# EAGLE design PrjBlinkenlights (EAGLE 5.12)
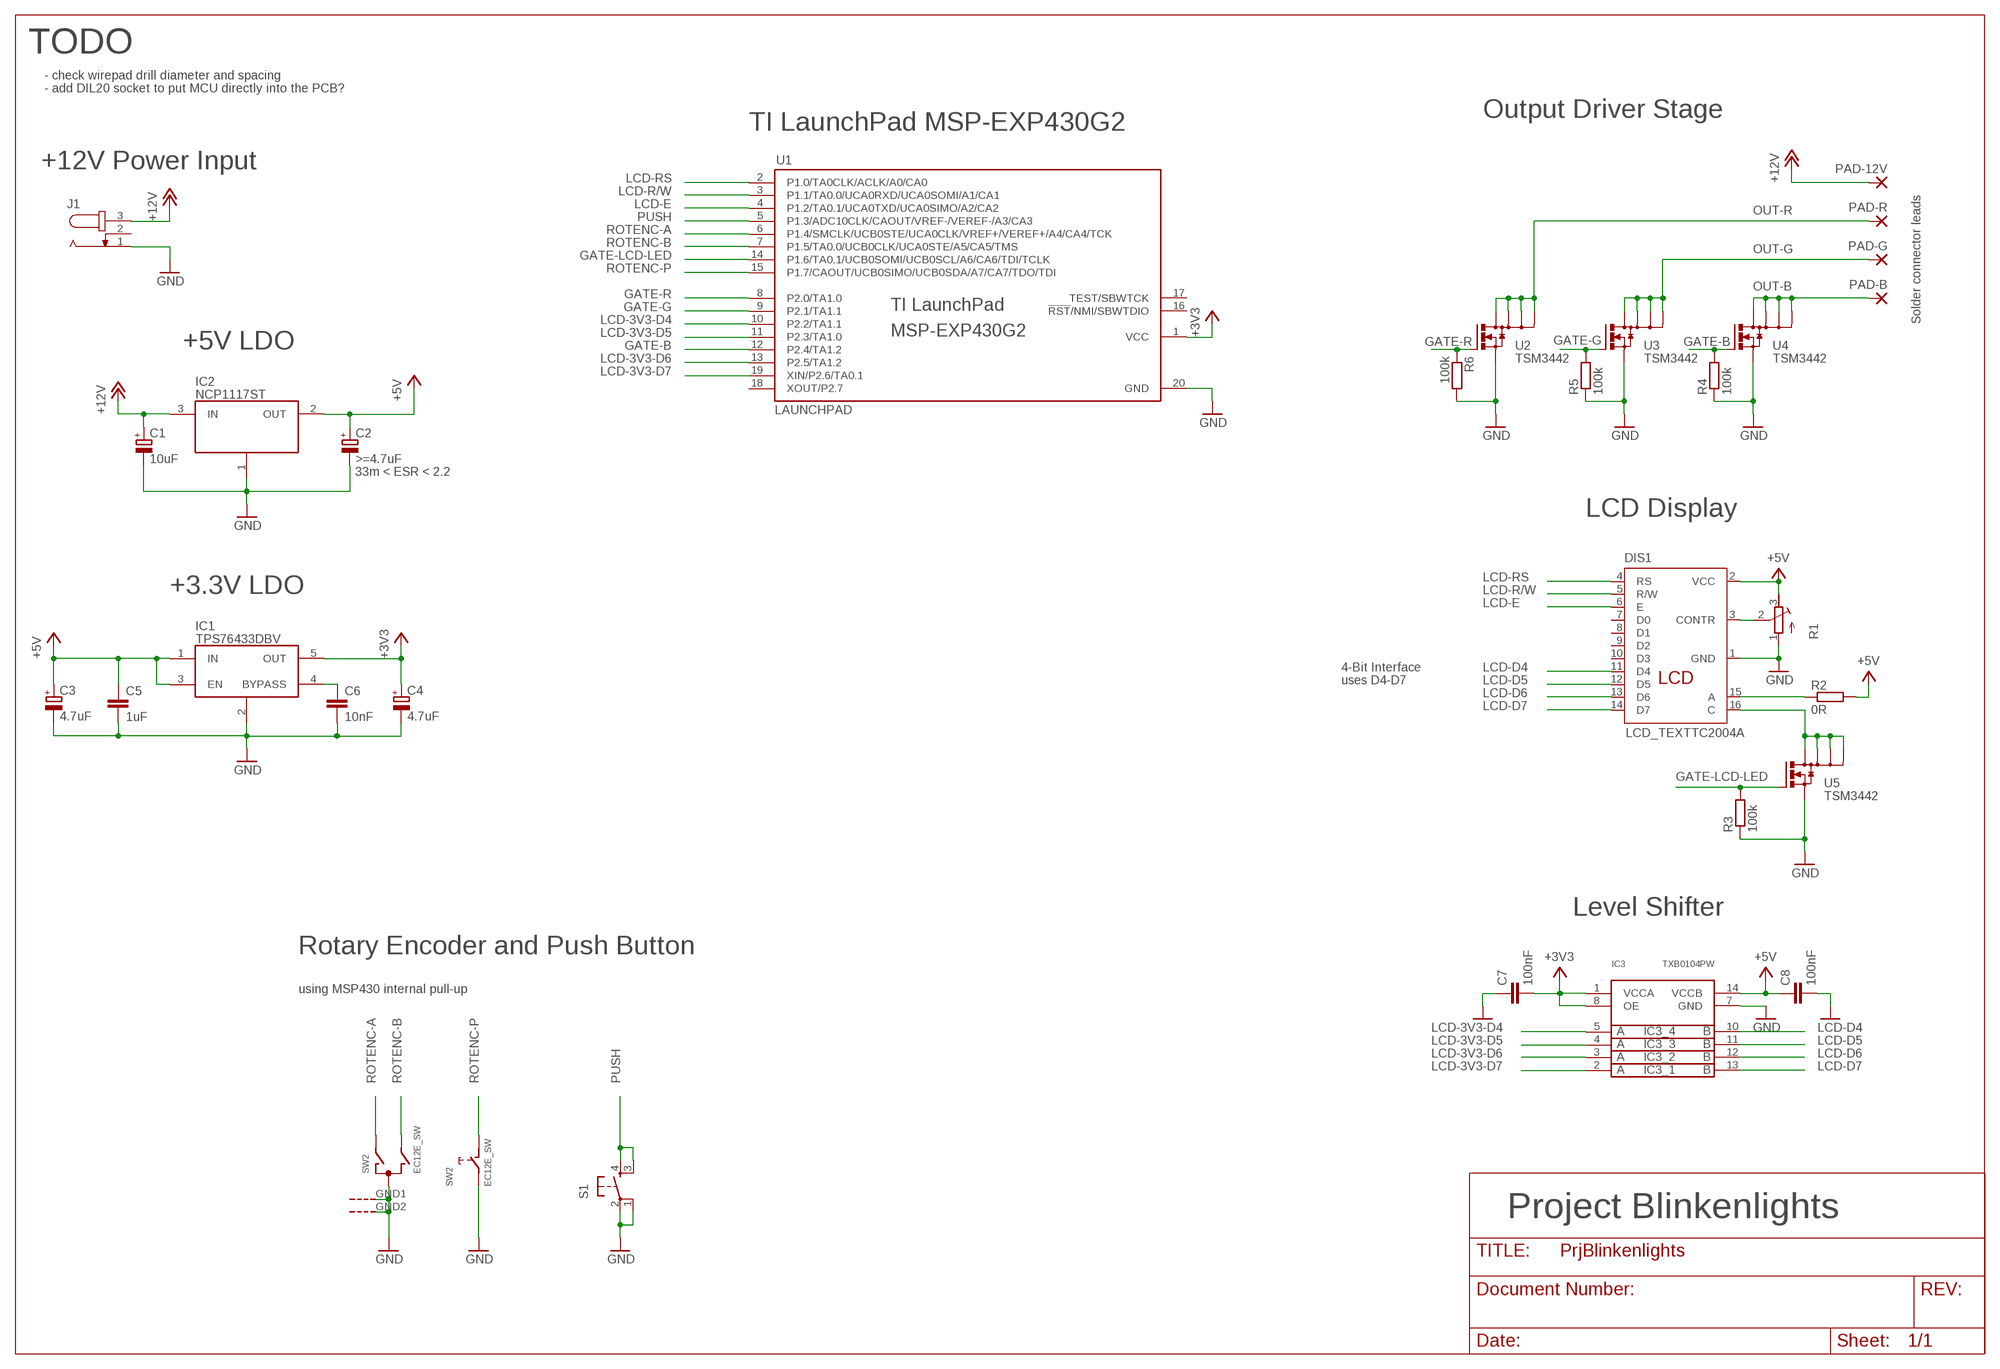
[diagram p0: schematic, sheet 1]

## Parts
C1  10uF  CPOL-EUCT3528  [CT3528]
C2  >=4.7uF  CPOL-EUCT3528  [CT3528]
C3  4.7uF  CPOL-EUCT3528  [CT3528]
C4  4.7uF  CPOL-EUCT3528  [CT3528]
C5  1uF  C-EUC0603  [C0603]
C6  10nF  C-EUC0603  [C0603]
C7  100nF  C-EUC0603  [C0603]
C8  100nF  C-EUC0603  [C0603]
DIS1  LCD_TEXTTC2004A  [TC2004A]
IC1  TPS76433DBV  [SOT23-5L]
IC2  NCP1117ST  [SOT223]
IC3  TXB0104PW  [R-PDSO-G14]
J1  JACK-PLUG0  [SPC4077]
PAD-12V  WIREPAD3,81/1,4  [3,81/1,4]
PAD-B  WIREPAD3,81/1,4  [3,81/1,4]
PAD-G  WIREPAD3,81/1,4  [3,81/1,4]
PAD-R  WIREPAD3,81/1,4  [3,81/1,4]
R1  R-TRIMM64P  [RTRIM64P]
R2  0R  R-EU_R0603  [R0603]
R3  100k  R-EU_R0603  [R0603]
R4  100k  R-EU_R0603  [R0603]
R5  100k  R-EU_R0603  [R0603]
R6  100k  R-EU_R0603  [R0603]
S1  SMD-BUTTON  [SMD-BUTTON]
SW2  EC12E_SW  [ALPS_EC12E_SW]
U1  LAUNCHPAD  [LAUNCHPAD]
U2  TSM3442  [SOT23-6]
U3  TSM3442  [SOT23-6]
U4  TSM3442  [SOT23-6]
U5  TSM3442  [SOT23-6]

## Nets
+3V3: C4.+ C7.2 IC1.5(OUT) IC3.1(:VCCA) IC3.8(:OE) U1.1(VCC)
+5V: C2.+ C3.+ C5.1 C8.1 DIS1.2(VCC) IC1.1(IN) IC1.3(EN) IC2.2(OUT) IC3.14(:VCCB) R1.3(E) R2.2
+12V: C1.+ IC2.3(IN) J1.3 PAD-12V.1(P)
BYPASS: C6.1 IC1.4(BYPASS)
CONTR: DIS1.3(CONTR) R1.2(S)
GATE-B: R4.2 U1.12(P2.4/TA1.2) U4.3(G)
GATE-G: R5.2 U1.9(P2.1/TA1.1) U3.3(G)
GATE-LCD-LED: R3.2 U1.14(P1.6/TA0.1/UCB0SOMI/UCB0SCL/A6/CA6/TDI/TCLK) U5.3(G)
GATE-R: R6.1 U1.8(P2.0/TA1.0) U2.3(G)
GND: C1.- C2.- C3.- C4.- C5.2 C6.2 C7.1 C8.2 DIS1.1(GND) IC1.2(GND) IC2.1(GND) IC3.7(:GND) J1.1 R1.1(A) R3.1 R4.1 R5.1 R6.2 S1.1 S1.2(P) SW2.C SW2.E SW2.GND1(G) SW2.GND2(G) U1.20(GND) U2.4(S) U3.4(S) U4.4(S) U5.4(S)
LCD-3V3-D4: IC3.5(_4:A) U1.10(P2.2/TA1.1)
LCD-3V3-D5: IC3.4(_3:A) U1.11(P2.3/TA1.0)
LCD-3V3-D6: IC3.3(_2:A) U1.13(P2.5/TA1.2)
LCD-3V3-D7: IC3.2(_1:A) U1.19(XIN/P2.6/TA0.1)
LCD-D4: DIS1.11(D4) IC3.10(_4:B)
LCD-D5: DIS1.12(D5) IC3.11(_3:B)
LCD-D6: DIS1.13(D6) IC3.12(_2:B)
LCD-D7: DIS1.14(D7) IC3.13(_1:B)
LCD-E: DIS1.6(E) U1.4(P1.2/TA0.1/UCA0TXD/UCA0SIMO/A2/CA2)
LCD-LED-A: DIS1.15(A) R2.1
LCD-LED-C: DIS1.16(C) U5.1(D1) U5.2(D2) U5.5(D3) U5.6(D4)
LCD-R/W: DIS1.5(R/W) U1.3(P1.1/TA0.0/UCA0RXD/UCA0SOMI/A1/CA1)
LCD-RS: DIS1.4(RS) U1.2(P1.0/TA0CLK/ACLK/A0/CA0)
OUT-B: PAD-B.1(P) U4.1(D1) U4.2(D2) U4.5(D3) U4.6(D4)
OUT-G: PAD-G.1(P) U3.1(D1) U3.2(D2) U3.5(D3) U3.6(D4)
OUT-R: PAD-R.1(P) U2.1(D1) U2.2(D2) U2.5(D3) U2.6(D4)
PUSH: S1.3(S1) S1.4(S) U1.5(P1.3/ADC10CLK/CAOUT/VREF-/VEREF-/A3/CA3)
ROTENC-A: SW2.A U1.6(P1.4/SMCLK/UCB0STE/UCA0CLK/VREF+/VEREF+/A4/CA4/TCK)
ROTENC-B: SW2.B U1.7(P1.5/TA0.0/UCB0CLK/UCA0STE/A5/CA5/TMS)
ROTENC-P: SW2.D U1.15(P1.7/CAOUT/UCB0SIMO/UCB0SDA/A7/CA7/TDO/TDI)
Unconnected: DIS1.7(D0) DIS1.8(D1) DIS1.9(D2) DIS1.10(D3) J1.2 U1.16(!RST!/NMI/SBWTDIO) U1.17(TEST/SBWTCK) U1.18(XOUT/P2.7)

## Notes on the sheet
- TODO
- - check wirepad drill diameter and spacing
- - add DIL20 socket to put MCU directly into the PCB?
- Output Driver Stage
- TI LaunchPad MSP-EXP430G2
- +12V Power Input
- Solder connector leads
- +5V LDO
- 33m < ESR < 2.2
- LCD Display
- +3.3V LDO
- 4-Bit Interface
- uses D4-D7
- Level Shifter
- Rotary Encoder and Push Button
- using MSP430 internal pull-up
- Project Blinkenlights

## Library data of the parts
C1-C4 = rcl:CPOL-EU: POLARIZED CAPACITOR, European symbol
C5-C8 = rcl:C-EU: CAPACITOR, European symbol
DIS1 = PrjBlinkenlights:LCD_TEXT: Vatronix Text LCD display reflective, with background light; OC_FARNELL: unknown; OC_NEWARK: unknown
IC1 = parts:TPS764*: TPS764xx LOW-POWER LOW-NOISE 150-mA LOW-DROPOUT LINEAR REGULATORS
IC2 = PrjBlinkenlights:NCP1117: ON Semiconductor 1.0 A Low-Dropout Positive Fixed and Adjustable Voltage Regulators SOT-223 Package (ST suffix): Heatsink tab is connected to Pin 2 (Output).
IC3 = PrjBlinkenlights:TXB0104: TXS0108E 4-BIT BIDIRECTIONAL VOLTAGE-LEVEL TRANSLATOR WITH AUTOMATIC DIRECTION SENSING AND ±15-kV ESD PROTECTION
J1 = con-jack:JACK-PLUG: DC POWER JACK Power Jack, DC, Right Angle, Through Hole, Rated 5A at 16VDC, PC Terminals Distributor: Farnell (www.Farnell.de) Drawing: 84N1161.pdf / 84N1162.pdf Manufacturer: SPC Technology (www.spctechnology.com) Type: SPC4077 / SPC 4078; OC_FARNELL: unknown; OC_NEWARK: unknown
PAD-12V PAD-B PAD-G PAD-R = wirepad:WIREPAD: Wire PAD connect wire on PCB
R1 = rcl:R-TRIMM: Trimm resistor
R2-R6 = rcl:R-EU_: RESISTOR, European symbol
S1 = PrjBlinkenlights:SMD-BUTTON: OMRON SWITCH
SW2 = switch-alps:EC12E_SW: ALPS rotary Encoder EC12E series with switch; MPN: EC12E2424407; OC_FARNELL: 1520813; OC_NEWARK: 74M1068
U1 = PrjBlinkenlights:LAUNCHPAD: TI LaunchPad MSP-EXP430G2
U2-U5 = PrjBlinkenlights:TSM3442: TSM3442 20V N-Channel MOSFET VDS < 20V VGS < ±8V ID < 4A Rθ,JA = 80°C/W VGS,th = 0.65-1.2V SOT-26 Package seems identical to SOT23-6

## Board
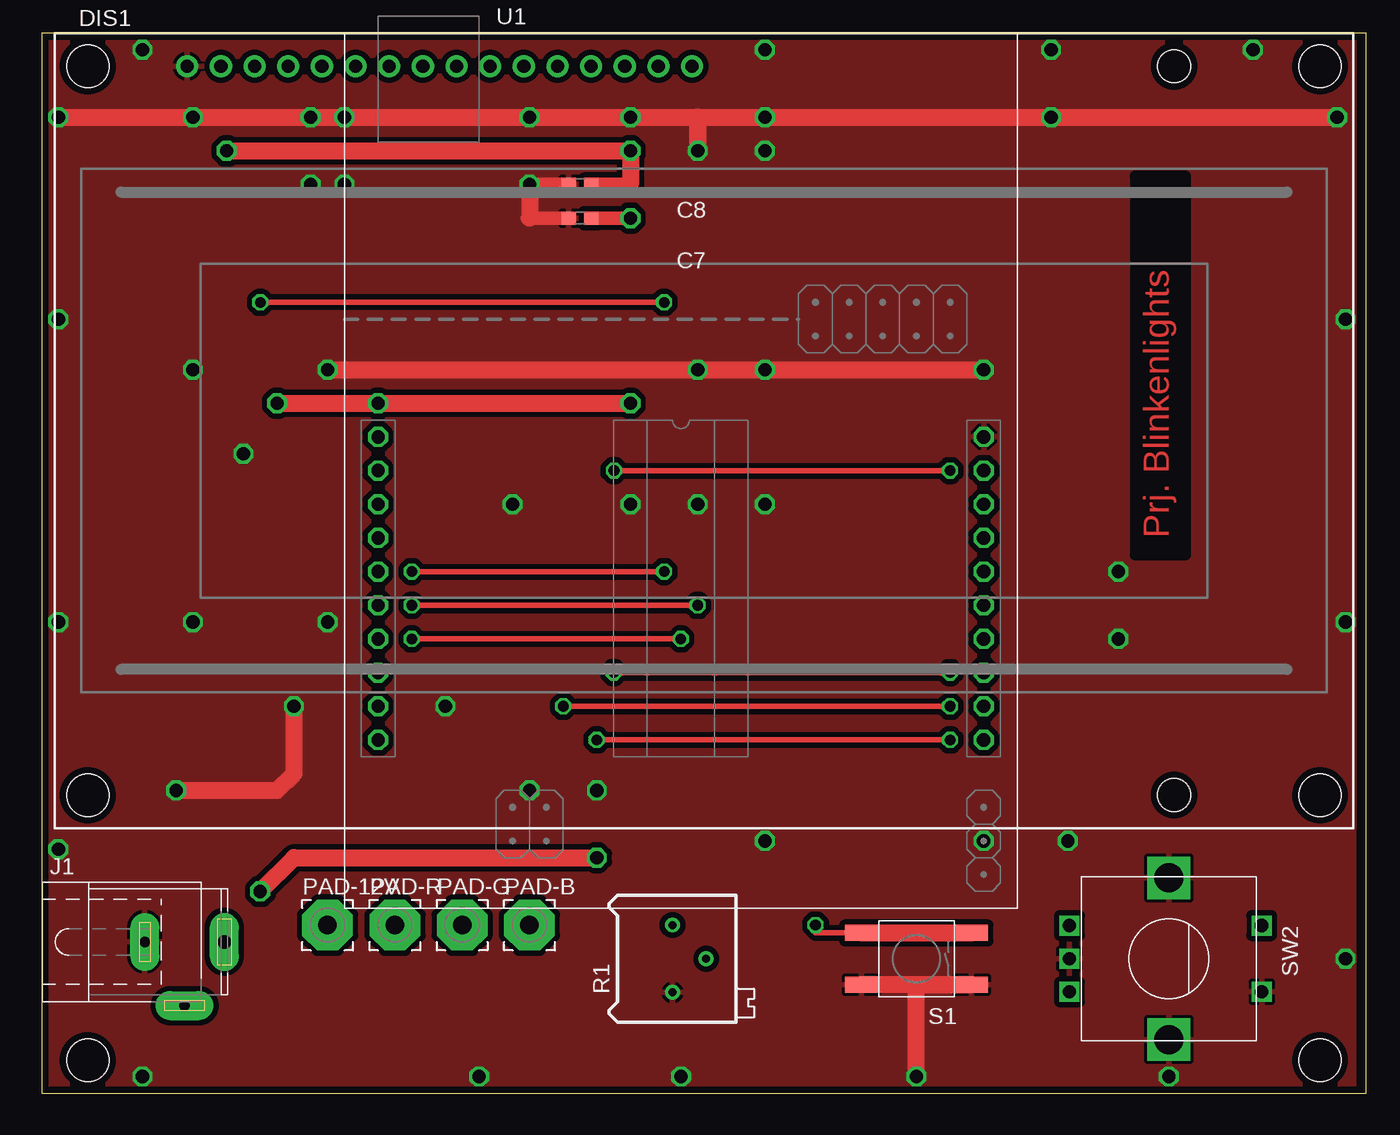
[diagram p1: board, top side]
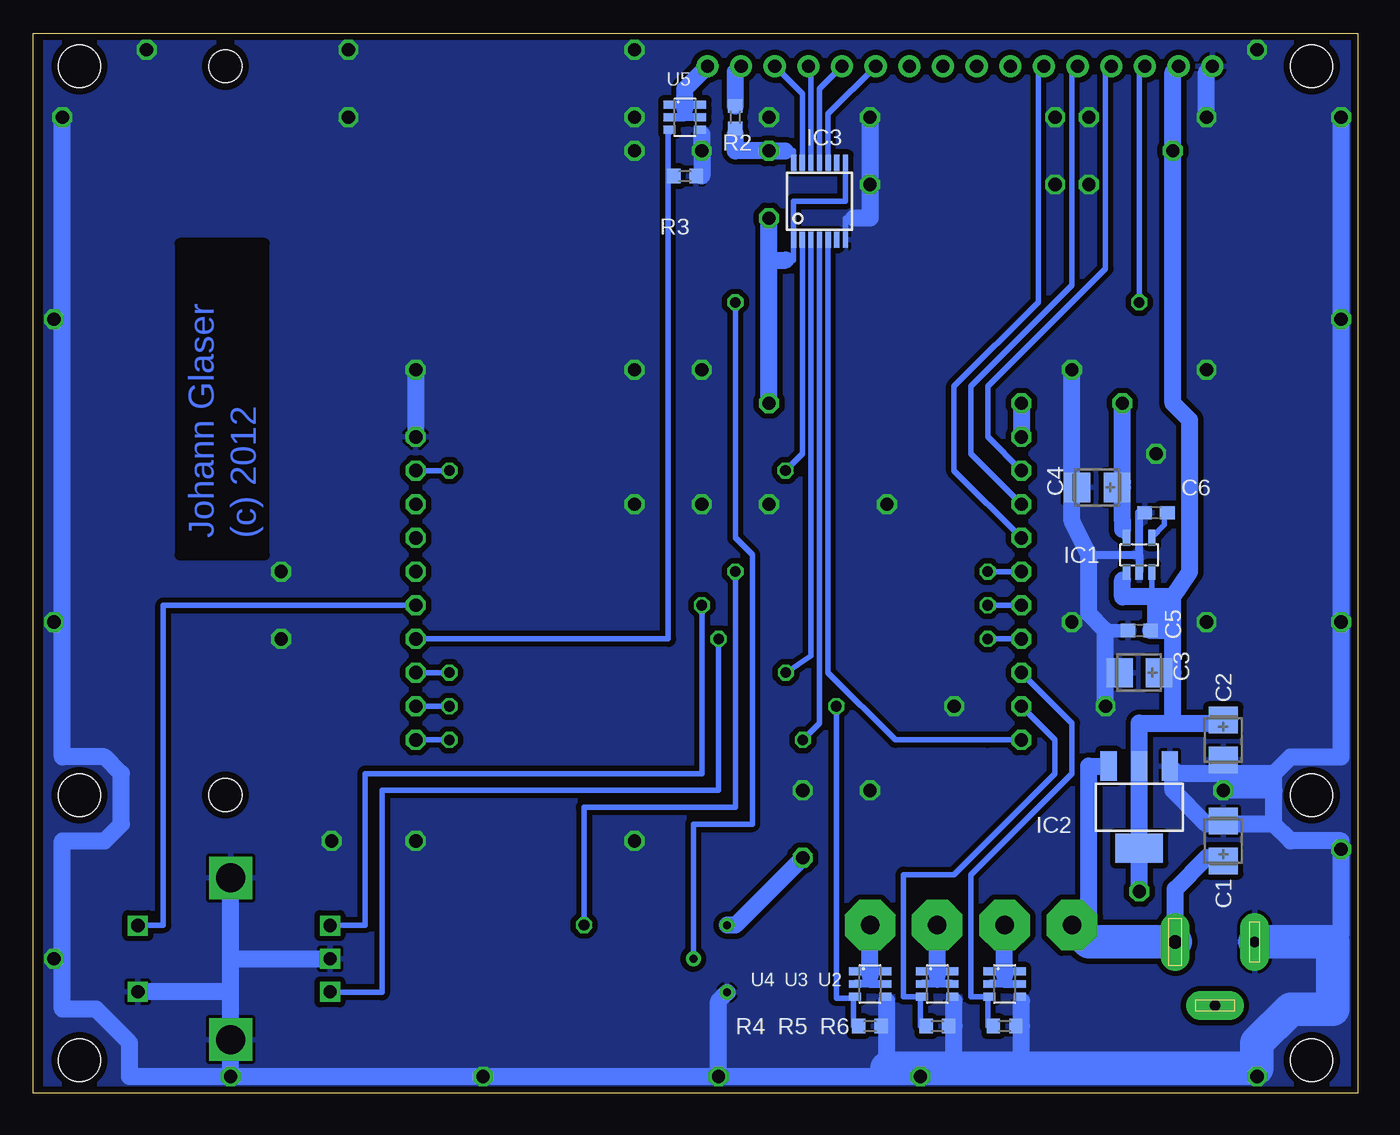
[diagram p2: board, bottom side, seen from below]

Size 100 x 80 mm. Coordinates in mm from the lower left corner, seen from the top.
Outline: 0,0 100,0 100,80 0,80 0,0
Copper layers (1*16): Top 0.035mm / dielectric 1.5mm / Bottom 0.035mm
Design rules "heger *": minimum track width 10mil, minimum drill 0.5mm, track to track 9mil, track to pad 9mil, pad to pad 9mil, via to via 10mil, smd to smd 8mil, copper to edge 20mil, drill to drill 0.5mm, minimum pad ring 10mil, minimum via ring 8mil, stop-mask expansion 4mil, vias tented up to drill 0mil, thermal gap 10mil
Holes 3.2 mm at 3.5,2.5 96.5,2.5
Holes 2.5 mm at 85.5,77.5 85.5,22.5
tRestrict: 4 lines
bRestrict: 4 lines

### Footprints (pad centres in the part's own frame; a part is rotated, then mirrored left to right if it is on the bottom)
CT3528 = smd 2 x 2.2: + -1.5,0; - 1.5,0
C0603 = smd 1.1 x 1: 1 -0.85,0; 2 0.85,0
TC2004A = drill 1 pad 1.676 round: 1 10,-2.5; 2 12.54,-2.5; 3 15.08,-2.5; 4 17.62,-2.5; 5 20.16,-2.5; 6 22.7,-2.5; 7 25.24,-2.5; 8 27.78,-2.5; 9 30.32,-2.5; 10 32.86,-2.5; 11 35.4,-2.5; 12 37.94,-2.5; 13 40.48,-2.5; 14 43.02,-2.5; 15 45.56,-2.5; 16 48.1,-2.5 | hole 3.2: 2.5,-57.5; 95.5,-57.5; 2.5,-2.5; 95.5,-2.5
SOT23-5L = smd 0.55 x 1.2: 1 -0.95,-1.3; 2 0,-1.3; 3 0.95,-1.3; 4 0.95,1.3; 5 -0.95,1.3
SOT223 = smd 1.219 x 2.235: 1 -2.311,-3.099; 2 0,-3.099; 3 2.311,-3.099 | smd 3.6 x 2.2: 4 0,3.099
R-PDSO-G14 = smd 0.4 x 1.2: 1 -1.95,-2.9; 2 -1.3,-2.9; 3 -0.65,-2.9; 4 0,-2.9; 5 0.65,-2.9; 6 1.3,-2.9; 7 1.95,-2.9; 8 1.95,2.9; 9 1.3,2.9; 10 0.65,2.9; 11 0,2.9; 12 -0.65,2.9; 13 -1.3,2.9; 14 -1.95,2.9
SPC4077 = drill 0.8 pad 2.184 long: 1 -3,0; 2 0,-4.8 | drill 1 pad 2.184 long: 3 3,0
3,81/1,4 = drill 1.397 pad 3.81 octagon: 1 0,0
RTRIM64P = drill 0.61 round: 1 0,-2.54; 2 2.54,0; 3 0,2.54
R0603 = smd 1 x 1.1: 1 -0.85,0; 2 0.85,0
SMD-BUTTON = smd 2.5 x 1.2: 1 -4.15,1.95; 2 4.15,1.95; 3 -4.15,-1.95; 4 4.15,-1.95
ALPS_EC12E_SW = drill 1 square: A -2.5,-7.5; B 2.5,-7.5; C 0,-7.5; D -2.5,7; E 2.5,7 | drill 2.2 square: GND1 -6.1,0; GND2 6.1,0
LAUNCHPAD = drill 1 octagon: 1 -22.86,11.43; 2 -22.86,8.89; 3 -22.86,6.35; 4 -22.86,3.81; 5 -22.86,1.27; 6 -22.86,-1.27; 7 -22.86,-3.81; 8 -22.86,-6.35; 9 -22.86,-8.89; 10 -22.86,-11.43; 11 22.86,-11.43; 12 22.86,-8.89; 13 22.86,-6.35; 14 22.86,-3.81; 15 22.86,-1.27; 16 22.86,1.27; 17 22.86,3.81; 18 22.86,6.35; 19 22.86,8.89; 20 22.86,11.43
SOT23-6 = smd 0.6 x 0.9: 1 -0.95,-1.15; 2 0,-1.15; 3 0.95,-1.15; 4 0.95,1.15; 5 0,1.15; 6 -0.95,1.15

### Placement (x,y rotation side)
C1  10.16,19.05 90 bottom
C2  10.16,26.67 270 bottom
C3  16.51,31.75 180 bottom
C4  19.68,45.72 180 bottom
C5  16.51,34.92 180 bottom
C6  15.24,43.81 180 bottom
C7  40.64,66.04 0 top
C8  40.64,68.58 180 top
DIS1  1,80 0 top
IC1  16.51,40.64 0 bottom
IC2  16.51,21.59 180 bottom
IC3  40.64,67.31 0 bottom
J1  10.79,11.43 0 top
PAD-12V  21.59,12.7 0 top
PAD-B  36.83,12.7 0 top
PAD-G  31.75,12.7 0 top
PAD-R  26.67,12.7 0 top
R1  47.62,10.16 0 top
R2  46.99,73.66 270 bottom
R3  50.8,69.22 180 bottom
R4  36.83,5.08 180 bottom
R5  31.75,5.08 180 bottom
R6  26.67,5.08 0 bottom
S1  66.04,10.16 180 top
SW2  85.09,10.16 270 top
U1  48.26,38.1 0 top
U2  26.67,8.26 270 bottom
U3  31.75,8.26 270 bottom
U4  36.83,8.26 270 bottom
U5  50.8,73.66 270 bottom

### Tracks (layer width: path | path; a pad name or v marks a point on that pad's centre or on a via)
+3V3  (via drill 1)
  Top 1.016: v44.45,66.04 C7.2
  Top 1.27: v17.78,52.07 v25.4,52.07 v44.45,52.07
  Bottom 0.406: IC3.8 38.69,67.31 42.59,67.31 IC3.1 42.59,62.87 43.18,62.87
  Bottom 0.61: IC1.5 17.78,42.26 17.78,43.18
  Bottom 1.27: v17.78,52.07 17.78,46.12 C4.+ 17.78,45.72 17.78,43.18 17.78,42.55 | v25.4,52.07 U1.1 | 44.45,62.87 v44.45,66.04 | 44.45,62.87 43.18,62.87 | v44.45,52.07 44.45,62.87
+5V  (via drill 1)
  Top 1.016: 44.45,68.58 C8.1
  Top 1.27: v13.97,71.12 v44.45,71.12 44.45,68.58 | v16.51,15.24 19.05,17.78 v41.91,17.78
  Bottom 0.406: 15.56,36.83 IC1.3 | 17.78,38.73 IC1.1 | 43.23,71.12 42.59,71.12 IC3.14
  Bottom 0.61: 15.24,37.47 15.24,36.83 15.56,36.83 | 46.99,72.39 R2.2
  Bottom 1.27: 13.97,27.94 16.51,27.94 IC2.2 v16.51,15.24 | 13.97,27.94 10.16,27.94 C2.+ | DIS1.2 13.97,77.07 v13.97,71.12 13.97,52.07 12.7,50.8 12.7,39.37 13.97,37.47 | 13.97,27.94 13.97,31.75 | 13.97,31.75 13.97,34.92 | 13.97,34.92 13.97,37.47 | 13.97,31.75 C3.+ | 13.97,34.92 15.24,34.92 | 15.24,34.92 C5.1 | 15.24,34.92 15.24,37.47 | 17.78,38.73 17.78,37.47 15.24,37.47 | 13.97,37.47 15.24,37.47 | 46.99,72.39 46.99,71.12 v44.45,71.12 43.23,71.12 | v41.91,17.78 46.99,12.7 R1.3
+12V
  Bottom 1.27: IC2.3 20.32,24.69 20.32,11.43 | J1.3 13.79,15.41 11.43,17.78 10.39,17.78 C1.+
  Bottom 2.54: J1.3 20.32,11.43 PAD-12V.1
BYPASS
  Bottom 0.406: IC1.4 14.61,42.9 14.61,43.81 C6.1
CONTR  (via drill 0.8)
  Top 0.406: v46.99,59.69 v16.51,59.69
  Bottom 0.406: R1.2 50.16,20.32 45.72,20.32 45.72,40.64 46.99,41.91 v46.99,59.69 | v16.51,59.69 16.51,77.07 DIS1.3
GATE-B  (via drill 0.8)
  Top 0.406: v39.37,29.21 v68.58,29.21
  Bottom 0.406: 38.1,7.18 U4.3 | 38.1,7.18 38.1,5.08 R4.2 | 38.1,7.18 39.37,7.18 v39.37,29.21 | v68.58,29.21 U1.12
GATE-G
  Bottom 0.406: R5.2 33.02,5.08 33.02,7.18 U3.3 34.29,7.3 34.29,16.51 30.48,16.51 22.86,24.13 22.86,26.67 U1.9
GATE-LCD-LED
  Bottom 0.406: U5.3 51.95,72.51 52.07,72.39 52.07,69.22 | 52.07,69.22 R3.2 | 52.07,69.22 52.07,34.29 U1.14
GATE-R
  Bottom 0.406: R6.1 27.94,5.08 27.94,7.18 U2.3 29.21,7.3 29.21,16.51 21.59,24.13 21.59,27.94 U1.8
GND  (via drill 1)
  Top 1.016: v36.83,68.58 C8.2 | 36.83,66.04 C7.1
  Top 1.27: v1.27,73.66 v11.43,73.66 v20.32,73.66 v22.86,73.66 v36.83,73.66 v44.45,73.66 49.53,73.66 | 49.53,73.66 v54.61,73.66 v76.2,73.66 v97.79,73.66 | v10.16,22.86 17.78,22.86 19.05,24.13 v19.05,29.21 | v21.59,54.61 v49.53,54.61 v54.61,54.61 v71.12,54.61 | v36.83,68.58 36.83,66.04 | 49.53,73.66 v49.53,71.12 | S1.2 S1.1 66.04,8.21 v66.04,1.27
  Bottom 0.406: 38.05,66.04 38.69,66.04 IC3.7
  Bottom 0.61: 26.67,1.91 25.52,1.91 | 30.48,6.99 U3.4 | 35.56,6.99 U4.4 | 25.4,6.99 U2.4 | 30.48,5.08 R5.1 | 35.56,5.08 R4.1 | 25.4,5.08 R6.2 | 20.32,40.64 16.51,40.64 | 16.51,40.64 IC1.2 | 16.51,40.64 16.51,43.81 C6.2 | 49.53,72.39 U5.4 | 49.53,69.22 R3.1
  Bottom 1.016: 19.05,34.92 C5.2
  Bottom 1.27: v48.26,1.27 35.56,1.27 35.56,1.91 35.56,5.08 35.56,6.99 | v48.26,1.27 v66.04,1.27 v85.09,1.27 | v85.09,1.27 92.71,1.27 92.71,3.81 95.25,6.35 97.79,6.35 97.79,19.05 94.61,19.05 93.34,20.32 93.34,24.13 94.61,25.4 97.79,25.4 v97.79,73.66 | 6.35,20.32 5.08,19.05 1.27,19.05 v1.27,18.41 1.27,12.06 1.91,11.43 | 6.35,20.32 6.35,22.86 | 6.35,22.86 6.35,24.13 | 6.35,24.13 5.08,25.4 1.27,25.4 v1.27,35.56 v1.27,58.42 v1.27,73.66 | DIS1.1 11.43,77.07 v11.43,73.66 | IC2.1 13.64,24.13 10.16,24.13 | 6.35,24.13 10.16,24.13 | 10.16,24.13 C2.- | 6.35,20.32 9.93,20.32 C1.- 10.16,20.32 11.43,20.32 13.97,22.86 13.97,24.13 | 30.48,1.91 30.48,5.08 30.48,6.99 | 25.4,1.91 25.4,5.08 25.4,6.99 | 6.35,22.86 v10.16,22.86 | v19.05,29.21 19.05,31.75 | 19.05,31.75 19.05,34.92 20.32,36.2 20.32,40.64 21.59,43.18 21.59,45.72 | 19.05,31.75 C3.- | 21.59,45.72 v21.59,54.61 | 21.59,45.72 C4.- | v71.12,54.61 U1.20 | v36.83,73.66 v36.83,68.58 36.83,66.04 38.05,66.04 | 49.53,69.22 v49.53,71.12 49.53,72.39 | v85.09,1.27 SW2.GND2 85.09,7.66 | 85.09,7.66 85.09,10.16 | 85.09,10.16 SW2.GND1 | 85.09,10.16 SW2.C | 85.09,7.66 SW2.E | R1.1 48.26,6.99 v48.26,1.27
  Bottom 2.54: J1.1 1.91,11.43 1.91,6.35 5.08,6.35 7.62,3.81 7.62,1.91 25.4,1.91 26.67,1.91 30.48,1.91 35.56,1.91
  other vias: 7.62,78.74 54.61,78.74 76.2,78.74 91.44,78.74 98.42,58.42 98.42,35.56 98.42,10.16 33.02,1.27 7.62,1.27 54.61,71.12 22.86,68.58 20.32,68.58 11.43,54.61 15.24,48.26 11.43,35.56 21.59,35.56 35.56,44.45 44.45,44.45 49.53,44.45 54.61,44.45 81.28,39.37 81.28,34.29 77.47,19.05 71.12,19.05 54.61,19.05 41.91,22.86 36.83,22.86 30.48,29.21
  pour Bottom (isolate 0.406): 0.64,79.38 0.64,0.64 99.06,0.64 99.06,79.38
  pour Top (isolate 0.406): 0.64,79.38 0.64,0.64 99.06,0.64 99.06,79.38
LCD-3V3-D4
  Bottom 0.406: U1.10 27.94,26.67 34.92,26.67 39.99,31.73 IC3.5
LCD-3V3-D5  (via drill 0.8)
  Top 0.406: v41.91,26.67 v68.58,26.67
  Bottom 0.406: v41.91,26.67 40.64,27.94 IC3.4 | v68.58,26.67 U1.11
LCD-3V3-D6  (via drill 0.8)
  Top 0.406: v43.18,31.75 v68.58,31.75
  Bottom 0.406: IC3.3 41.29,33.02 v43.18,31.75 | v68.58,31.75 U1.13
LCD-3V3-D7  (via drill 0.8)
  Top 0.406: v43.21,46.99 v68.58,46.99
  Bottom 0.406: 43.18,46.99 v43.21,46.99 41.94,48.26 IC3.2 | v68.58,46.99 U1.19
LCD-D4
  Bottom 0.406: DIS1.11 39.99,73.91 IC3.10
LCD-D5
  Bottom 0.406: DIS1.12 40.64,75.8 IC3.11
LCD-D6
  Bottom 0.406: DIS1.13 41.29,77.31 IC3.12
LCD-D7
  Bottom 0.406: DIS1.14 41.94,75.42 IC3.13
LCD-E
  Bottom 0.406: U1.4 30.48,46.99 30.48,53.34 24.13,59.69 24.13,77.07 DIS1.6
LCD-LED-A
  Bottom 1.27: DIS1.15 46.99,77.07 R2.1
LCD-LED-C
  Bottom 0.61: U5.5 U5.2 50.8,73.66 50.8,74.3 | U5.6 50.8,74.61 U5.1
  Bottom 1.27: DIS1.16 50.8,75.8 50.8,74.61 50.8,74.3
LCD-R/W
  Bottom 0.406: U1.3 29.21,48.26 29.21,53.34 21.59,60.96 21.59,77.07 DIS1.5
LCD-RS
  Bottom 0.406: U1.2 27.94,49.53 27.94,53.34 19.05,62.23 19.05,77.07 DIS1.4
OUT-B
  Bottom 0.61: 36.83,8.26 U4.2 | 36.83,8.26 U4.5 | 36.83,8.26 36.83,8.89 36.83,9.21 | 36.83,9.21 U4.1 | U4.6 36.83,9.21
  Bottom 1.27: 36.83,8.89 PAD-B.1
OUT-G
  Bottom 0.61: 31.75,8.26 U3.2 | 31.75,8.26 31.75,8.89 31.75,9.21 | 31.75,9.21 U3.1 | 31.75,9.21 U3.6 | U3.5 31.75,8.26
  Bottom 1.27: 31.75,8.89 PAD-G.1
OUT-R
  Bottom 0.61: 26.67,8.26 U2.2 | 26.67,8.26 U2.5 | 26.67,8.26 26.67,8.89 26.67,9.21 | 26.67,9.21 U2.6 | U2.1 26.67,9.21
  Bottom 1.27: 26.67,8.89 PAD-R.1
PUSH  (via drill 0.8)
  Top 0.406: v27.94,39.37 v46.99,39.37 | S1.4 58.42,12.11 v58.42,12.7
  Top 1.27: S1.4 S1.3
  Bottom 0.406: U1.5 v27.94,39.37 | v46.99,39.37 46.99,21.59 58.42,21.59 v58.42,12.7
ROTENC-A  (via drill 0.8)
  Top 0.406: v27.94,36.83 v49.53,36.83
  Bottom 0.406: U1.6 v27.94,36.83 | v49.53,36.83 49.53,24.13 74.93,24.13 74.93,12.7 77.59,12.7 SW2.A
ROTENC-B  (via drill 0.8)
  Top 0.406: v27.94,34.29 v48.26,34.29
  Bottom 0.406: U1.7 v27.94,34.29 | v48.26,34.29 48.26,22.86 73.66,22.86 73.66,7.62 77.59,7.62 SW2.B
ROTENC-P
  Bottom 0.406: U1.15 90.17,36.83 90.17,12.7 92.09,12.7 SW2.D

### Text on the board
Top: Prj. Blinkenlights
Bottom: (c) 2012 | Johann Glaser